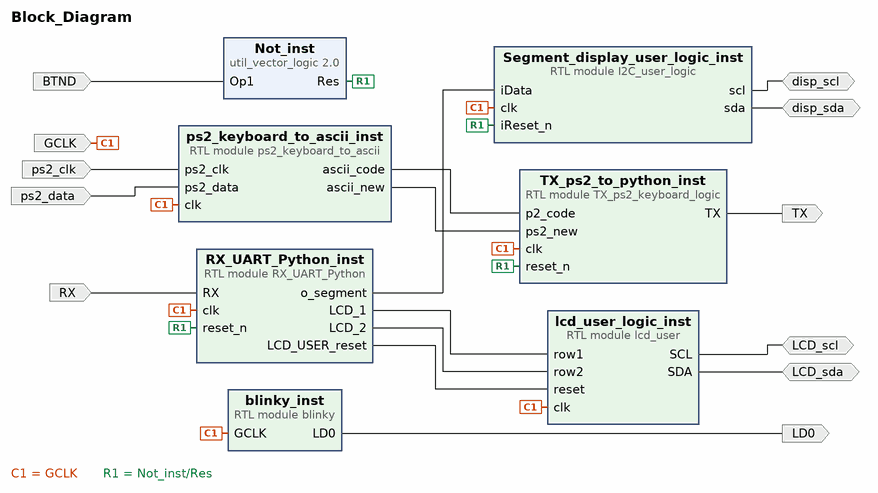
[diagram p0: block diagram of the top level]
# Vivado block design Block_Diagram, xc7z020clg484-1, Vivado 2022.2
create_bd_design Block_Diagram

create_bd_port -dir I GCLK
create_bd_port -dir O LD0
create_bd_port -dir O TX
create_bd_port -dir I BTND
create_bd_port -dir IO disp_scl
create_bd_port -dir IO disp_sda
create_bd_port -dir IO LCD_sda
create_bd_port -dir IO LCD_scl
create_bd_port -dir I -type clk ps2_clk
set_property -dict {CONFIG.FREQ_HZ 100000000} [get_bd_ports ps2_clk]
create_bd_port -dir I ps2_data
create_bd_port -dir I RX

create_bd_cell -type ip -vlnv xilinx.com:ip:util_vector_logic:2.0 Not_inst
set_property -dict {CONFIG.C_OPERATION not CONFIG.C_SIZE 1} [get_bd_cells Not_inst]
create_bd_cell -type module -reference I2C_user_logic Segment_display_user_logic_inst
create_bd_cell -type module -reference blinky blinky_inst
create_bd_cell -type module -reference TX_ps2_keyboard_logic TX_ps2_to_python_inst
create_bd_cell -type module -reference ps2_keyboard_to_ascii ps2_keyboard_to_ascii_inst
create_bd_cell -type module -reference lcd_user lcd_user_logic_inst
set_property -dict {CONFIG.input_clk 100000000} [get_bd_cells lcd_user_logic_inst]
create_bd_cell -type module -reference RX_UART_Python RX_UART_Python_inst

# ---- connections ----

connect_bd_net [get_bd_ports BTND] [get_bd_pins Not_inst/Op1]
connect_bd_net [get_bd_ports GCLK] \
  [get_bd_pins Segment_display_user_logic_inst/clk] [get_bd_pins blinky_inst/GCLK] [get_bd_pins TX_ps2_to_python_inst/clk] \
  [get_bd_pins ps2_keyboard_to_ascii_inst/clk] [get_bd_pins lcd_user_logic_inst/clk] [get_bd_pins RX_UART_Python_inst/clk]
connect_bd_net [get_bd_ports disp_scl] [get_bd_pins Segment_display_user_logic_inst/scl]
connect_bd_net [get_bd_ports disp_sda] [get_bd_pins Segment_display_user_logic_inst/sda]
connect_bd_net [get_bd_ports LCD_sda] [get_bd_pins lcd_user_logic_inst/SDA]
connect_bd_net [get_bd_ports LCD_scl] [get_bd_pins lcd_user_logic_inst/SCL]
connect_bd_net [get_bd_ports RX] [get_bd_pins RX_UART_Python_inst/RX]
connect_bd_net -net RX_UART_Python_0_LCD_1 [get_bd_pins RX_UART_Python_inst/LCD_1] [get_bd_pins lcd_user_logic_inst/row1]
connect_bd_net -net RX_UART_Python_0_LCD_2 [get_bd_pins RX_UART_Python_inst/LCD_2] [get_bd_pins lcd_user_logic_inst/row2]
connect_bd_net -net RX_UART_Python_0_LCD_USER_reset [get_bd_pins RX_UART_Python_inst/LCD_USER_reset] [get_bd_pins lcd_user_logic_inst/reset]
connect_bd_net -net RX_UART_Python_0_o_segment [get_bd_pins RX_UART_Python_inst/o_segment] [get_bd_pins Segment_display_user_logic_inst/iData]
connect_bd_net -net TX_ps2_keyboard_logic_0_TX [get_bd_pins TX_ps2_to_python_inst/TX] [get_bd_ports TX]
connect_bd_net -net blinky_0_LD0 [get_bd_pins blinky_inst/LD0] [get_bd_ports LD0]
connect_bd_net [get_bd_ports ps2_clk] [get_bd_pins ps2_keyboard_to_ascii_inst/ps2_clk]
connect_bd_net [get_bd_ports ps2_data] [get_bd_pins ps2_keyboard_to_ascii_inst/ps2_data]
connect_bd_net -net ps2_keyboard_to_ascii_0_ascii_code [get_bd_pins ps2_keyboard_to_ascii_inst/ascii_code] [get_bd_pins TX_ps2_to_python_inst/p2_code]
connect_bd_net -net ps2_keyboard_to_ascii_0_ascii_new [get_bd_pins ps2_keyboard_to_ascii_inst/ascii_new] [get_bd_pins TX_ps2_to_python_inst/ps2_new]
connect_bd_net -net util_vector_logic_0_Res [get_bd_pins Not_inst/Res] \
  [get_bd_pins Segment_display_user_logic_inst/iReset_n] [get_bd_pins TX_ps2_to_python_inst/reset_n] \
  [get_bd_pins RX_UART_Python_inst/reset_n]

validate_bd_design
save_bd_design
